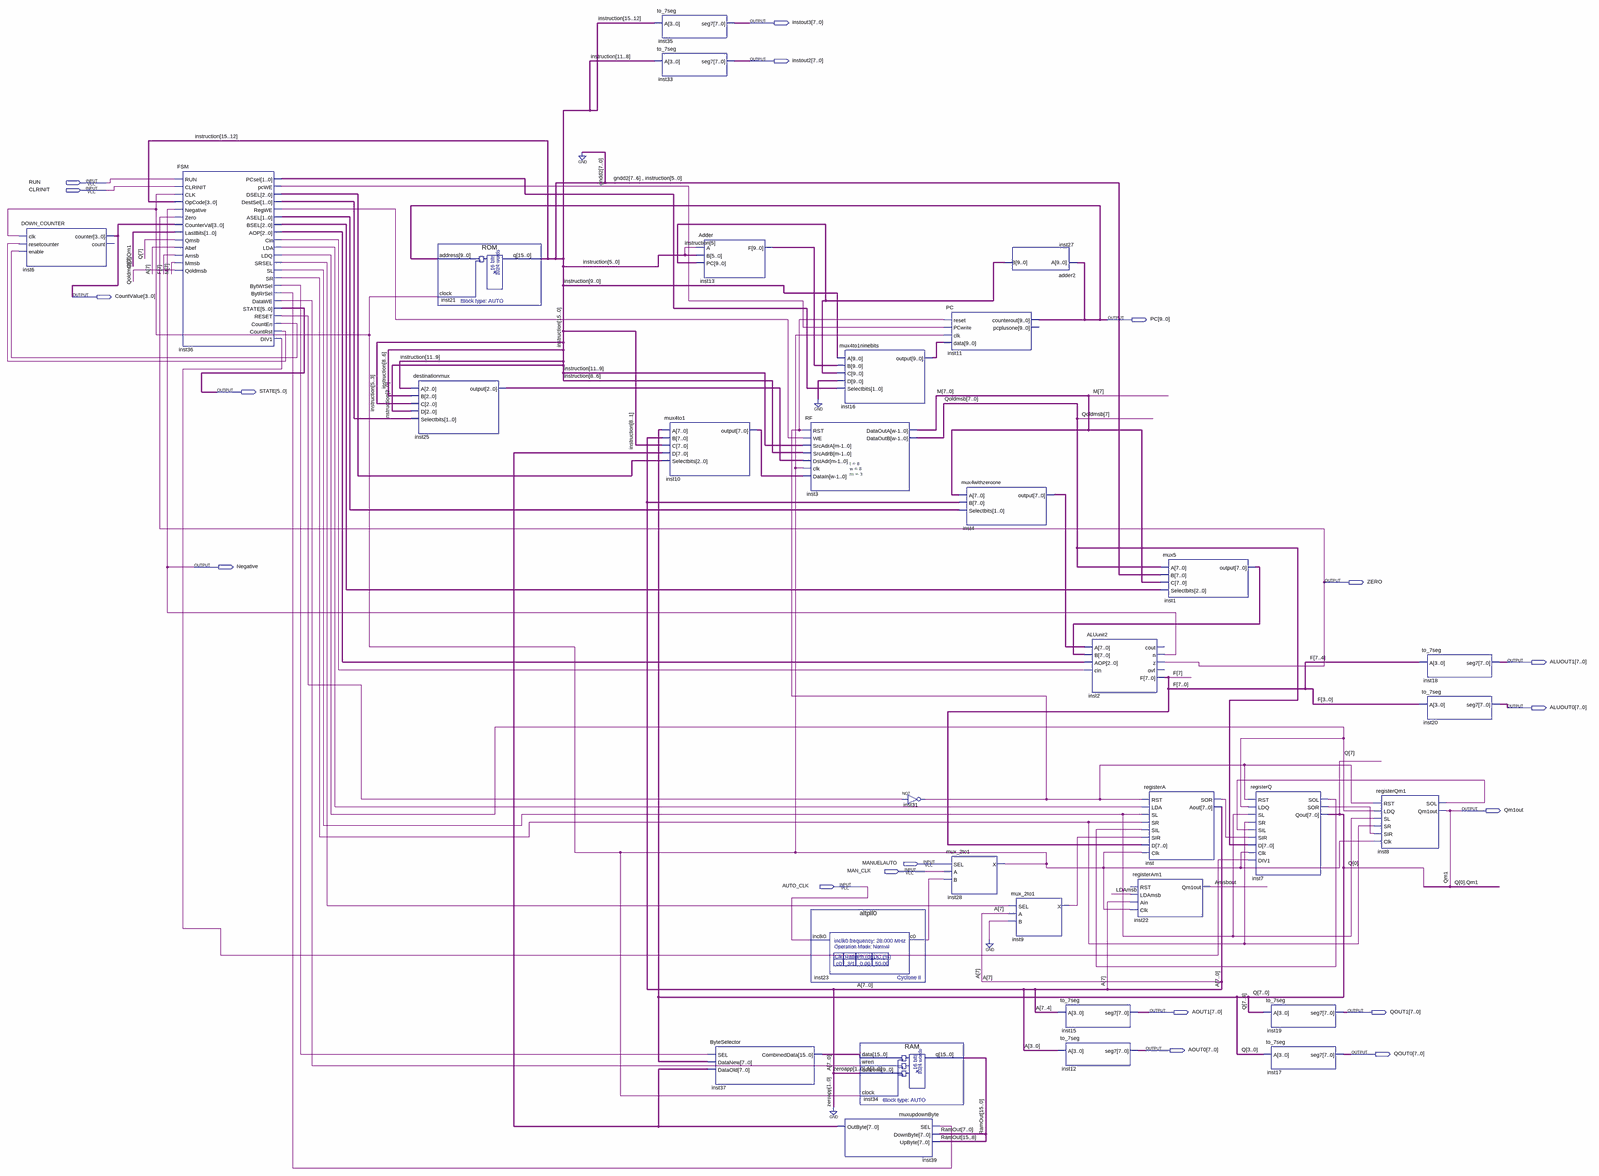
[diagram p0: schematic sheet, whole]
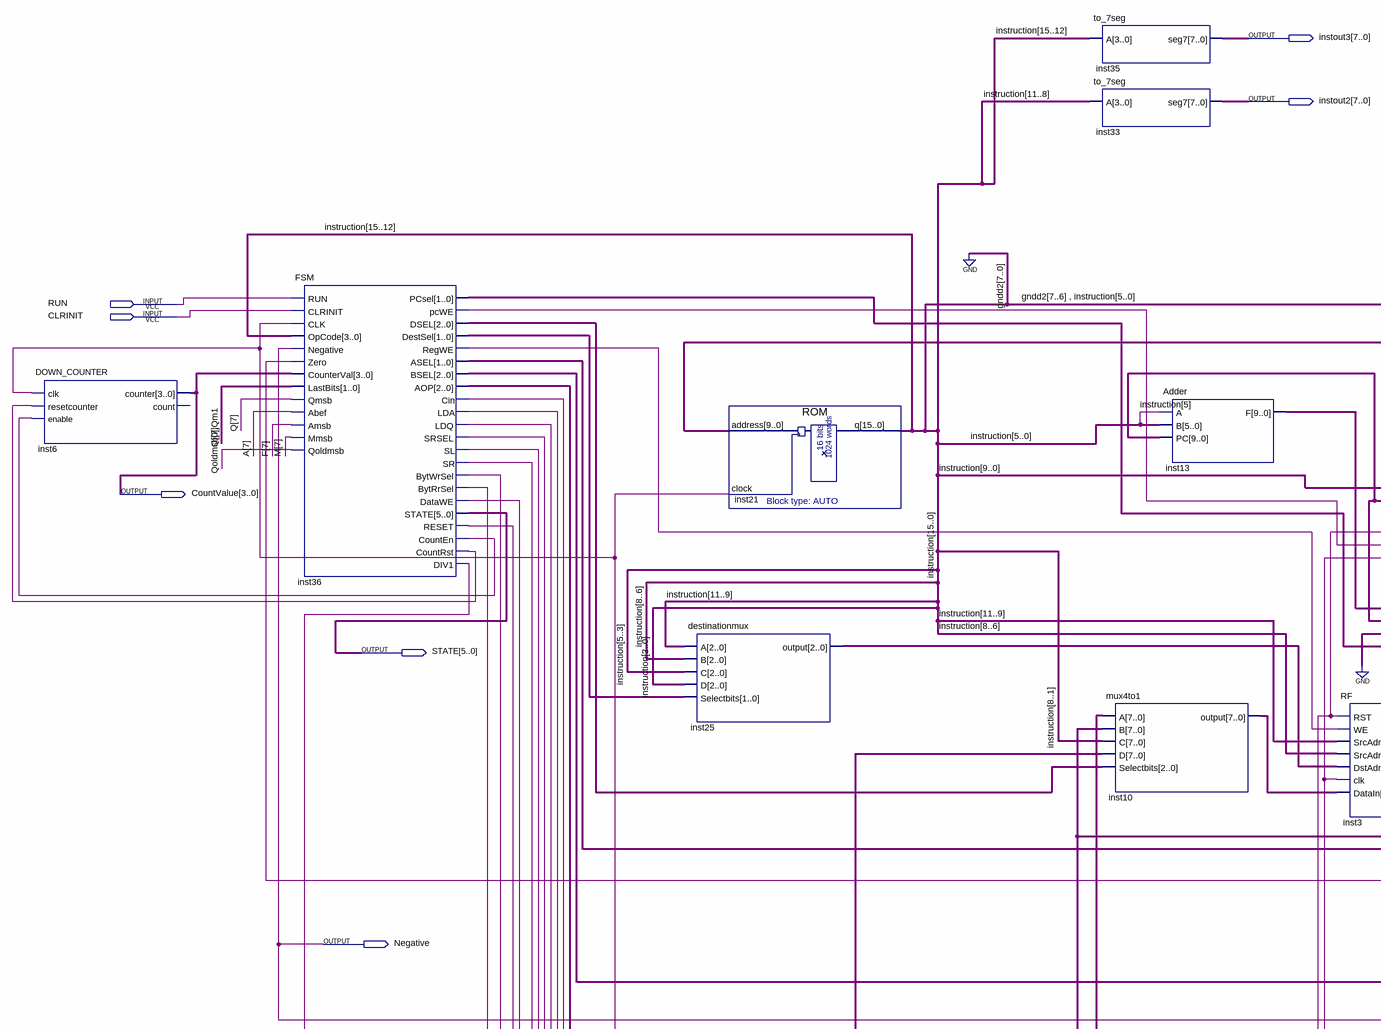
[diagram p1: schematic sheet, upper left part]
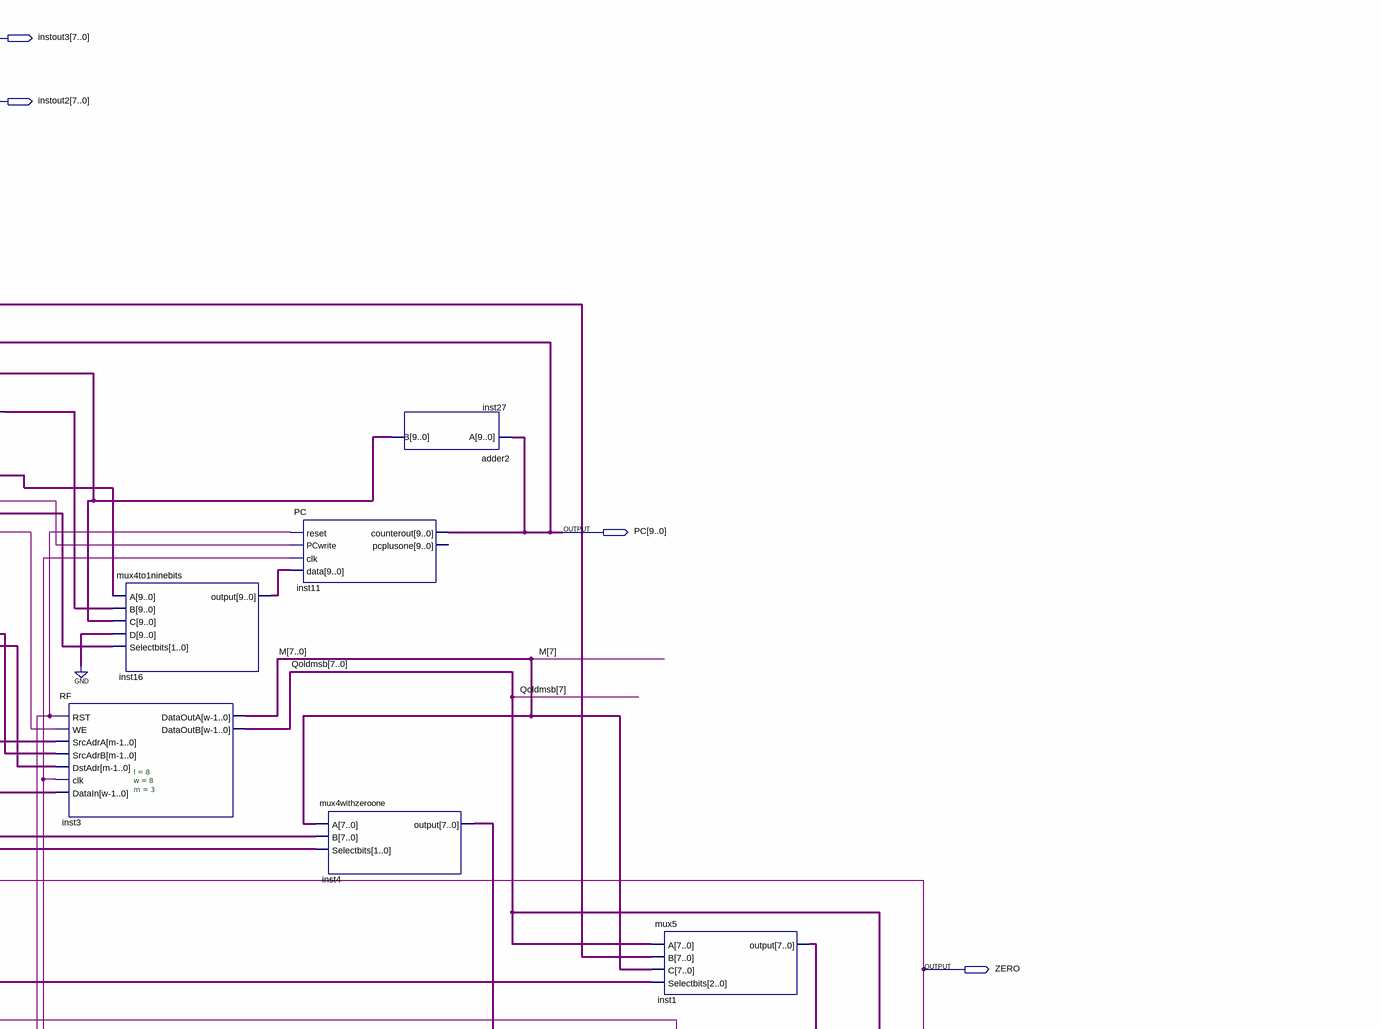
[diagram p2: schematic sheet, upper right part]
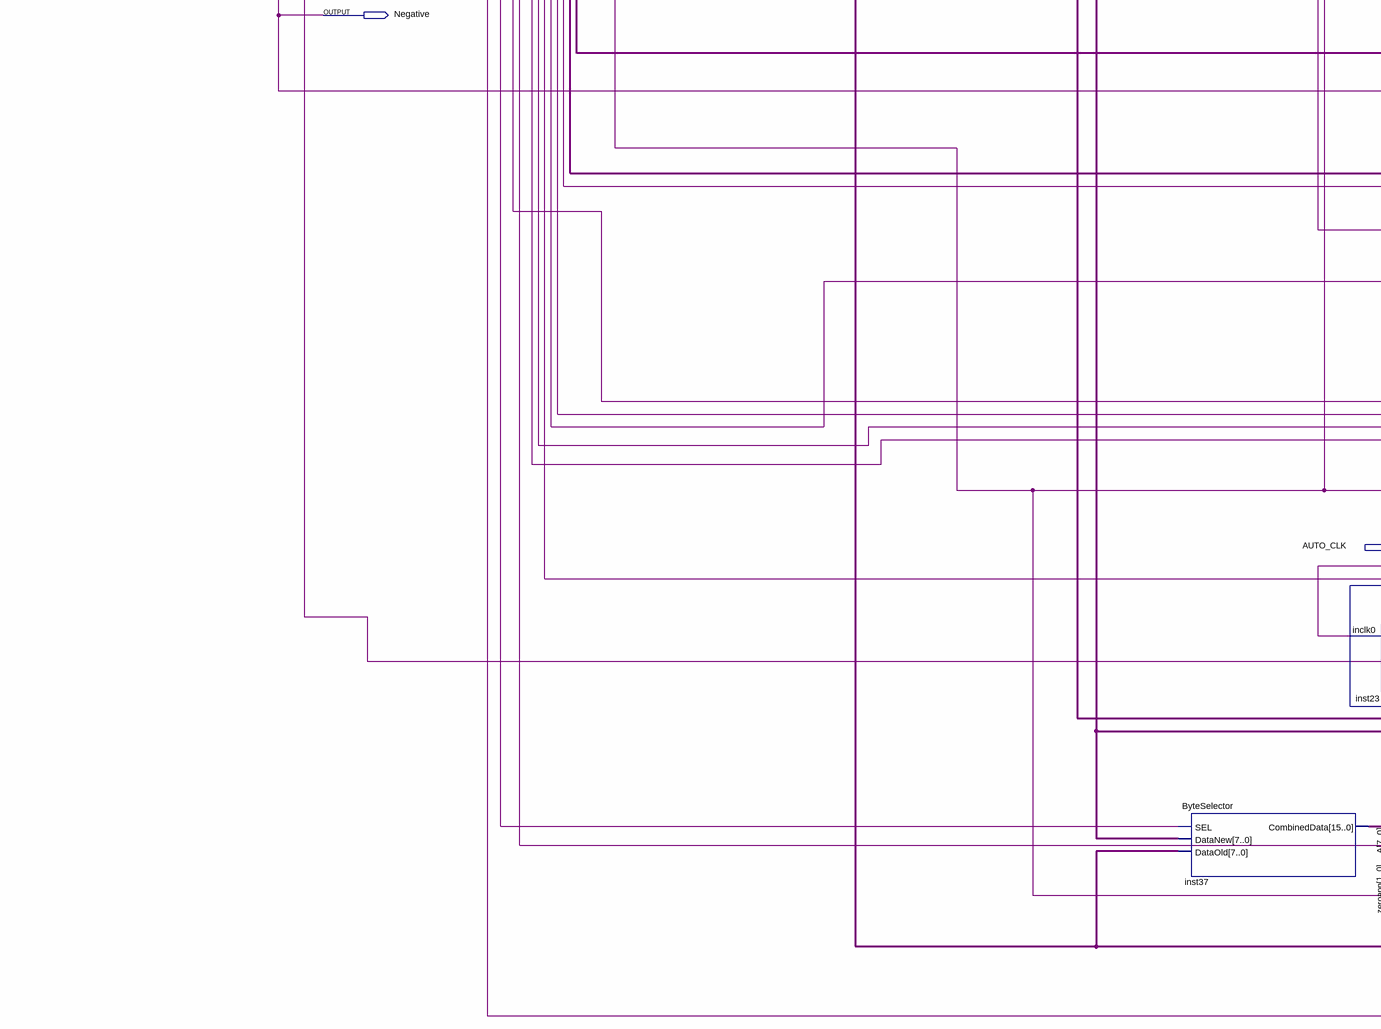
[diagram p3: schematic sheet, lower left part]
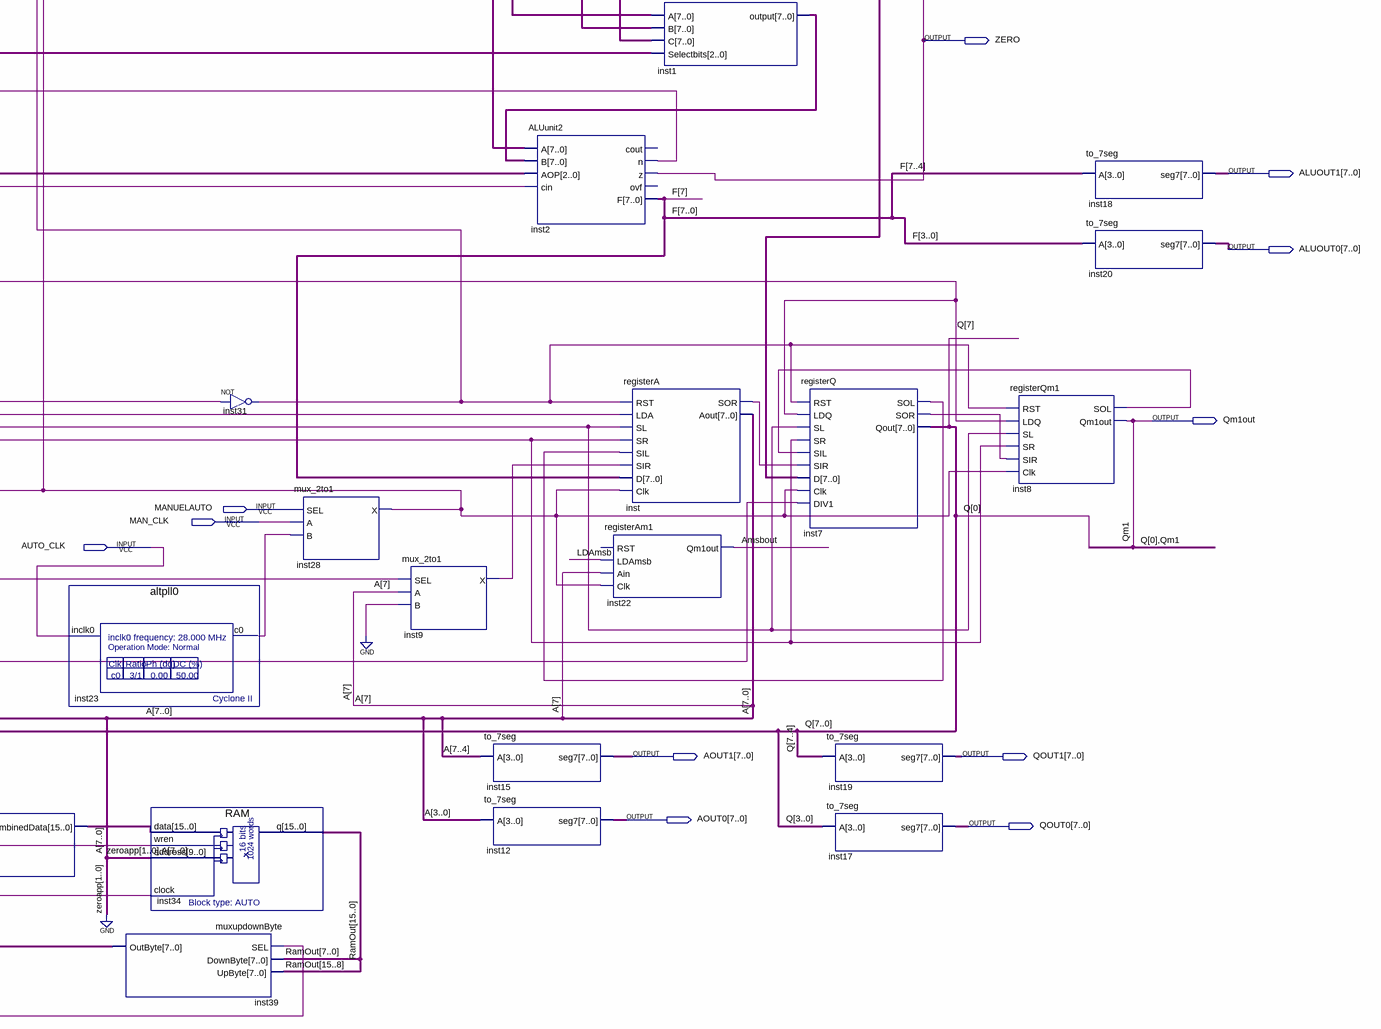
[diagram p4: schematic sheet, lower right part]
// Quartus schematic Datapath.bdf as structural Verilog: 32 symbols, 19 pins
module Datapath (
  input  RUN,
  input  CLRINIT,
  input  MANUELAUTO,
  input  MAN_CLK,
  input  AUTO_CLK,
  output [7:0] instout3,
  output [7:0] instout2,
  output [3:0] CountValue,
  output [9:0] PC,
  output [5:0] STATE,
  output Negative,
  output ZERO,
  output [7:0] ALUOUT1,
  output [7:0] ALUOUT0,
  output Qm1out,
  output [7:0] AOUT1,
  output [7:0] QOUT1,
  output [7:0] AOUT0,
  output [7:0] QOUT0
);

  wire Amsbout, inst7_sol, inst7_sor, inst8_sol, inst9_x, inst23_c0, inst28_x, inst31_out, inst36_bytrrsel,
       inst36_bytwrsel, inst36_cin, inst36_counten, inst36_countrst, inst36_datawe, inst36_div1, inst36_lda,
       inst36_ldq, inst36_pcwe, inst36_regwe, inst36_reset, inst36_sl, inst36_sr, inst36_srsel, inst_sor,
       LDAmsb;
  wire [1:0] inst36_asel, inst36_destsel, inst36_pcsel;
  wire [2:0] inst25_output, inst36_aop, inst36_bsel, inst36_dsel;
  wire [7:0] A, F, inst1_output, inst4_output, inst10_output, inst39_outbyte, M, Q, Qoldmsb;
  wire [9:0] inst13_f, inst16_output, inst27_b;
  wire [15:0] inst37_combineddata, instruction, RamOut;

  DOWN_COUNTER inst6 (
    .clk(inst28_x), .resetcounter(inst36_countrst), .enable(inst36_counten), .counter(CountValue));  // open: count
  FSM inst36 (
    .RUN(RUN), .CLRINIT(CLRINIT), .CLK(inst28_x), .OpCode(instruction[15:12]), .Negative(Negative),
    .Zero(ZERO), .CounterVal(CountValue), .LastBits({Q[0], Qm1out}), .Qmsb(Q[7]), .Abef(A[7]), .Amsb(F[7]),
    .Mmsb(M[7]), .Qoldmsb(Qoldmsb[7]), .PCsel(inst36_pcsel), .pcWE(inst36_pcwe), .DSEL(inst36_dsel),
    .DestSel(inst36_destsel), .RegWE(inst36_regwe), .ASEL(inst36_asel), .BSEL(inst36_bsel), .AOP(inst36_aop),
    .Cin(inst36_cin), .LDA(inst36_lda), .LDQ(inst36_ldq), .SRSEL(inst36_srsel), .SL(inst36_sl),
    .SR(inst36_sr), .BytWrSel(inst36_bytwrsel), .BytRrSel(inst36_bytrrsel), .DataWE(inst36_datawe),
    .STATE(STATE), .RESET(inst36_reset), .CountEn(inst36_counten), .CountRst(inst36_countrst),
    .DIV1(inst36_div1));
  destinationmux inst25 (
    .A(instruction[11:9]), .B(instruction[8:6]), .C(instruction[5:3]), .D(instruction[2:0]),
    .Selectbits(inst36_destsel), .\output (inst25_output));
  ROM inst21 (.address(PC), .clock(inst28_x), .q(instruction));
  to_7seg inst35 (.A(instruction[15:12]), .seg7(instout3));
  to_7seg inst33 (.A(instruction[11:8]), .seg7(instout2));
  mux4to1 inst10 (
    .A(Q), .B(A), .C(instruction[8:1]), .D(inst39_outbyte), .Selectbits(inst36_dsel), .\output (inst10_output));
  Adder inst13 (.A(instruction[5]), .B(instruction[5:0]), .PC(inst27_b), .F(inst13_f));
  ByteSelector inst37 (
    .SEL(inst36_bytwrsel), .DataNew(Q), .DataOld(inst39_outbyte), .CombinedData(inst37_combineddata));
  RF #(.l(8), .w(8), .m(3)) inst3 (
    .RST(inst31_out), .WE(inst36_regwe), .SrcAdrA(instruction[11:9]), .SrcAdrB(instruction[8:6]),
    .DstAdr(inst25_output), .clk(inst28_x), .DataIn(inst10_output), .DataOutA(M), .DataOutB(Qoldmsb));
  mux4to1ninebits inst16 (
    .A(instruction[9:0]), .B(inst13_f), .C(inst27_b), .D({10{1'b0}}), .Selectbits(inst36_pcsel),
    .\output (inst16_output));
  altpll0 inst23 (.inclk0(AUTO_CLK), .c0(inst23_c0));
  muxupdownByte inst39 (.SEL(inst36_bytrrsel), .DownByte(RamOut[7:0]), .UpByte(RamOut[15:8]), .OutByte(inst39_outbyte));
  RAM inst34 (.data(inst37_combineddata), .wren(inst36_datawe), .address({2'b00, A}), .clock(inst28_x), .q(RamOut));
  not inst31 (inst31_out, inst36_reset);
  PC inst11 (
    .reset(inst31_out), .PCwrite(inst36_pcwe), .clk(inst28_x), .data(inst16_output), .counterout(PC));  // open: pcplusone
  mux4withzeroone inst4 (.A(M), .B(A), .Selectbits(inst36_asel), .\output (inst4_output));
  mux_2to1 inst28 (.SEL(MANUELAUTO), .A(MAN_CLK), .B(inst23_c0), .X(inst28_x));
  adder2 inst27 (.A(PC), .B(inst27_b));
  mux_2to1 inst9 (.SEL(inst36_srsel), .A(A[7]), .B(1'b0), .X(inst9_x));
  to_7seg inst15 (.A(A[7:4]), .seg7(AOUT1));
  to_7seg inst12 (.A(A[3:0]), .seg7(AOUT0));
  ALUunit2 inst2 (
    .A(inst4_output), .B(inst1_output), .AOP(inst36_aop), .cin(inst36_cin), .n(Negative), .z(ZERO), .F(F));  // open: cout, ovf
  registerA inst (
    .RST(inst31_out), .LDA(inst36_lda), .SL(inst36_sl), .SR(inst36_sr), .SIL(inst7_sol), .SIR(inst9_x),
    .D(F), .Clk(inst28_x), .SOR(inst_sor), .Aout(A));
  registerAm1 inst22 (.LDAmsb(LDAmsb), .Ain(A[7]), .Clk(inst28_x), .Qm1out(Amsbout));  // open: RST
  mux5 inst1 (.A(Qoldmsb), .B({2'b00, instruction[5:0]}), .C(M), .Selectbits(inst36_bsel), .\output (inst1_output));
  registerQ inst7 (
    .RST(inst31_out), .LDQ(inst36_ldq), .SL(inst36_sl), .SR(inst36_sr), .SIL(inst8_sol), .SIR(inst_sor),
    .D(Qoldmsb), .Clk(inst28_x), .DIV1(inst36_div1), .SOL(inst7_sol), .SOR(inst7_sor), .Qout(Q));
  to_7seg inst19 (.A(Q[7:4]), .seg7(QOUT1));
  to_7seg inst17 (.A(Q[3:0]), .seg7(QOUT0));
  registerQm1 inst8 (
    .RST(inst31_out), .LDQ(inst36_ldq), .SL(inst36_sl), .SR(inst36_sr), .SIR(inst7_sor), .Clk(inst28_x),
    .SOL(inst8_sol), .Qm1out(Qm1out));
  to_7seg inst18 (.A(F[7:4]), .seg7(ALUOUT1));
  to_7seg inst20 (.A(F[3:0]), .seg7(ALUOUT0));

  // Other names for the same wires on the sheet: Qm1 = Qm1out
endmodule
